# Altium project EGB220_ControlBoard.prjpcb
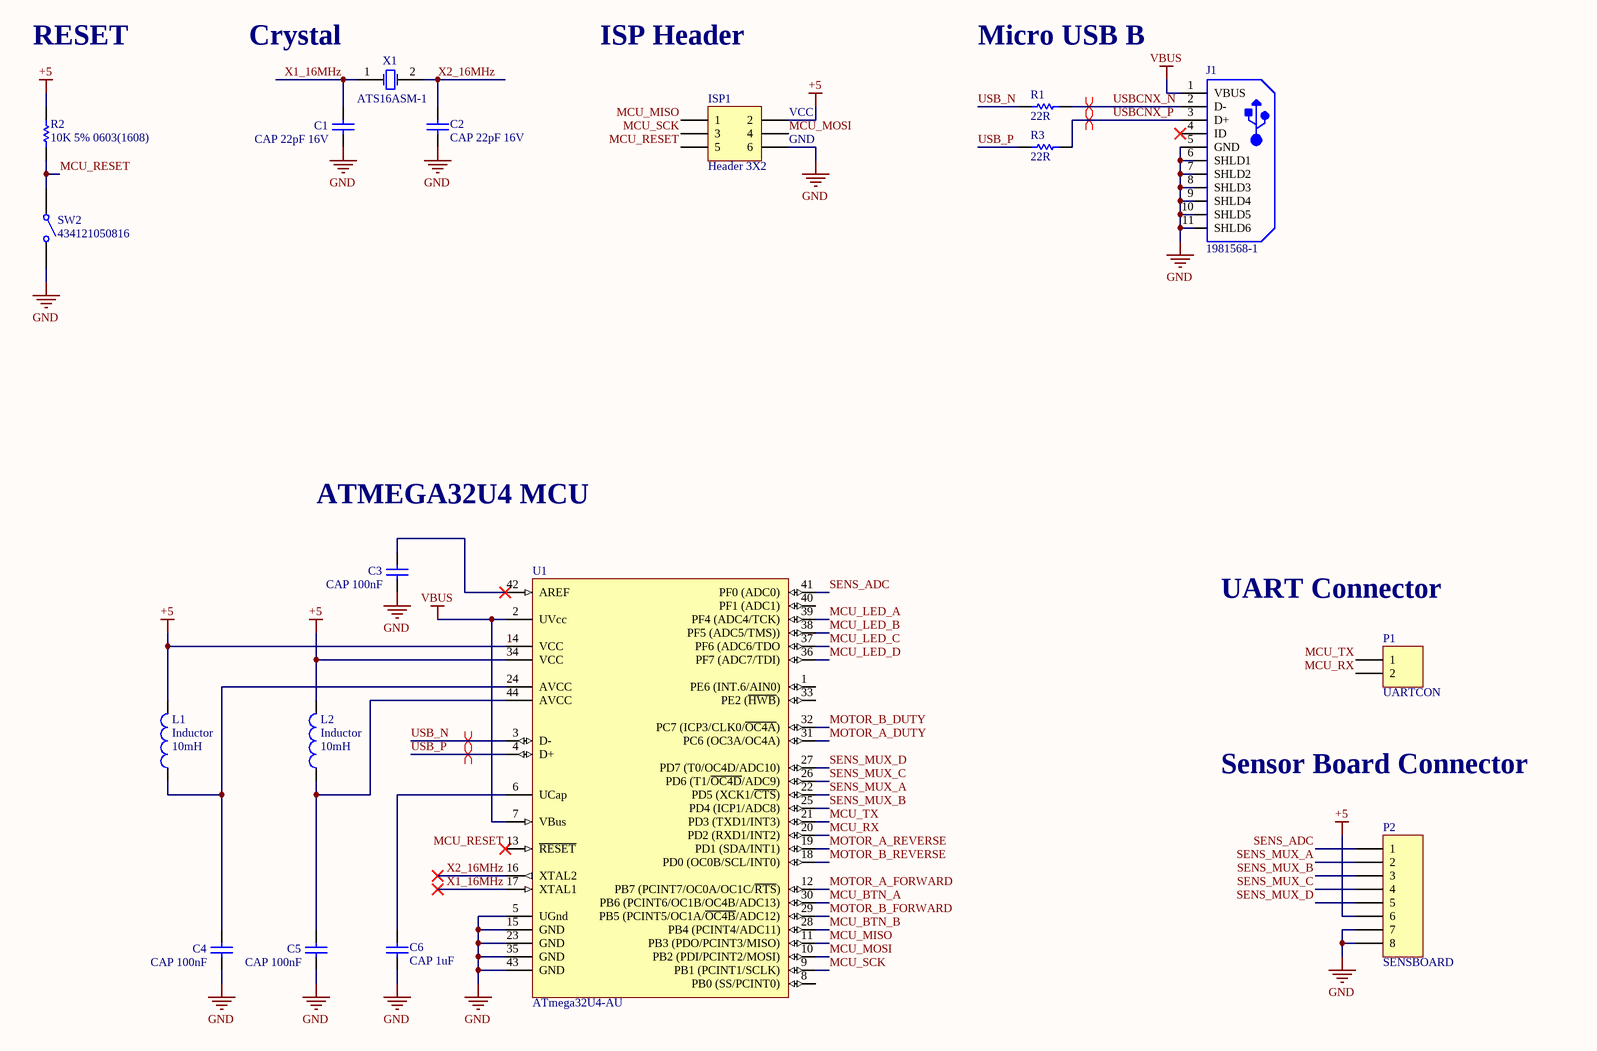
[diagram p0: Control.SchDoc]
4 sheets, 47 parts. Net scope: global (net labels, ports and power ports of the same name join across sheets).
Board file: Board.PcbDoc
Sheets:
  Control.SchDoc
  Input.SchDoc
  MotorDriver.SchDoc
  LinearRegulator.SchDoc

## Sheet Control.SchDoc: EGB220_ControlBoard
size A3

### Parts
C1  CAP 22pF 16V  [CAPC0603(1608)100_N]
C2  CAP 22pF 16V  [CAPC0603(1608)100_N]
C3  CAP 100nF  [CAPC0603(1608)100_M]
C4  CAP 100nF  [CAPC0603(1608)100_M]
C5  CAP 100nF  [CAPC0603(1608)100_M]
C6  CAP 1uF  [CAPC0603(1608)100_L]
ISP1  Header 3X2  [HDR2X3]
J1  1981568-1  [TECO-1981568-5_V]
L1  Inductor  value 10mH  [0603]
L2  Inductor  value 10mH  [0603]
P1  UARTCON  [HDR1X2]
P2  SENSBOARD  [HDR1X8]
R1  22R  [RESC0603(1608)_N]
R2  10K 5% 0603(1608)  [RESC0603(1608)_N]
R3  22R  [RESC0603(1608)_N]
SW2  434121050816  [434121050816]
U1  ATmega32U4-AU  [44ML_M]
X1  ATS16ASM-1  [CTS-ATS-SM-XTAL-2]

### Nets
+5: ISP1.2 L1.2 L2.2 P2.6 R2.2 U1.14(VCC) U1.34(VCC)
GND: C1.1 C2.2 C3.1 C4.1 C5.1 C6.1 ISP1.6 J1.5(GND) J1.6(SHLD1) J1.7(SHLD2) J1.8(SHLD3) J1.9(SHLD4) J1.10(SHLD5) J1.11(SHLD6) P2.7 P2.8 SW2.2 U1.5(UGnd) U1.15(GND) U1.23(GND) U1.35(GND) U1.43(GND)
VBUS: J1.1(VBUS) U1.2(UVcc) U1.7(VBus)
MCU_BTN_A: U1.30(PB6_(PCINT6/OC1B/OC4B/ADC13))
MCU_BTN_B: U1.28(PB4_(PCINT4/ADC11))
MCU_LED_A: U1.39(PF4_(ADC4/TCK))
MCU_LED_B: U1.38(PF5_(ADC5/TMS)))
MCU_LED_C: U1.37(PF6_(ADC6/TDO)
MCU_LED_D: U1.36(PF7_(ADC7/TDI))
MCU_MISO: ISP1.1 U1.11(PB3_(PDO/PCINT3/MISO))
MCU_MOSI: ISP1.4 U1.10(PB2_(PDI/PCINT2/MOSI))
MCU_RESET: ISP1.5 R2.1 SW2.1 U1.13(~{RESET})
MCU_RX: P1.2 U1.20(PD2_(RXD1/INT2))
MCU_SCK: ISP1.3 U1.9(PB1_(PCINT1/SCLK))
MCU_TX: P1.1 U1.21(PD3_(TXD1/INT3))
MOTOR_A_DUTY: U1.31(PC6_(OC3A/OC4A))
MOTOR_A_FORWARD: U1.12(PB7_(PCINT7/OC0A/OC1C/~{RTS}))
MOTOR_A_REVERSE: U1.19(PD1_(SDA/INT1))
MOTOR_B_DUTY: U1.32(PC7_(ICP3/CLK0/~{OC4A}))
MOTOR_B_FORWARD: U1.29(PB5_(PCINT5/OC1A/~{OC4B}/ADC12))
MOTOR_B_REVERSE: U1.18(PD0_(OC0B/SCL/INT0))
SENS_ADC: P2.1 U1.41(PF0_(ADC0))
SENS_MUX_A: P2.2 U1.22(PD5_(XCK1/~{CTS}))
SENS_MUX_B: P2.3 U1.25(PD4_(ICP1/ADC8))
SENS_MUX_C: P2.4 U1.26(PD6_(T1/~{OC4D}/ADC9))
SENS_MUX_D: P2.5 U1.27(PD7_(T0/OC4D/ADC10))
USB_N: R1.1 U1.3(D-)
USB_P: R3.1 U1.4(D+)
USBCNX_N: J1.2(D-) R1.2
USBCNX_P: J1.3(D+) R3.2
X1_16MHz: C1.2 U1.17(XTAL1) X1.1(X1)
X2_16MHz: C2.1 U1.16(XTAL2) X1.2(X2)
NetC3_2: C3.2 U1.42(AREF)
NetC4_2: C4.2 L1.1 U1.24(AVCC)
NetC5_2: C5.2 L2.1 U1.44(AVCC)
NetC6_2: C6.2 U1.6(UCap)

Not connected (* = marked no-connect by the designer): J1 4(ID)*; U1 1(PE6_(INT.6/AIN0)) 8(PB0_(SS/PCINT0)) 33(PE2_(~{HWB})) 40(PF1_(ADC1))

### Layout directives
differential pair: USB_N, USB_P, USBCNX_N, USBCNX_P

### Notes on the sheet
- RESET
- Crystal
- ISP Header
- Micro USB B
- (near ISP1) VCC
- (near ISP1) GND
- ATMEGA32U4 MCU
- UART Connector
- Sensor Board Connector
- Title
- Size:
- Date:
- A3
- Number:
- Time:
- Revision:
- Sheet
- of
- File:

### Library data of the parts
C1 C2 = CMP-1035-00808-1: CAP 22pF 16V ±5% 0603 (1608 Metric) Thickness 1mm SMD; Tolerance: Â±5%; Case-EIA: 0603; Case-Metric: 1608; Technology: SMT; Value: 22pF; Rated Voltage: 16 V; Max Thickness: 1 mm
C3-C5 = CMP-1035-02583-1: CAP 100nF 16V ±5% 0603 (1608 Metric) Thickness 1mm SMD; Tolerance: Â±5%; Case-Metric: 1608; Case-EIA: 0603; Rated Voltage: 16 V; Max Thickness: 1 mm; Technology: SMT; Value: 100nF
C6 = CMP-1035-02740-1: CAP 1uF 25V ±10% 0603 (1608 Metric) Thickness 1mm SMD; Tolerance: Â±10%; Case-Metric: 1608; Case-EIA: 0603; Technology: SMT; Rated Voltage: 25 V; Max Thickness: 1 mm; Value: 1uF
ISP1 = Header 3X2: Header, 3-Pin, Dual row; LatestRevisionDate: 17-Jul-2002; LatestRevisionNote: Re-released for DXP Platform.; Publisher: Altium Limited
J1 = CMP-2000-05408-1: Micro USB Receptacle Standard Type B Assy, 5-Pin SMD, RoHS, Tape and Reel; Manufacturer: TE Connectivity; Body Orientation: RightAngle; Number of Ports: 1Port; Number of Contacts: 5POS; Gender: RCP; Voltage Rating Max: 30VAC; Product Depth (mm): 5.6mm; Pitch (mm): 0.65mm; Current Rating (Max): 1/ContactA; Product Length (mm): 8mm; Product Height (mm): 3mm; Operating Temperature Max Deg. C: 85C; Datasheet URL: http://www.mouser.com/ds/2/418/NG_CD_1981568_E2-621296.pdf; Termination Method: Solder; Number of Terminals: 5; Operating Temp Range: -55Cto85C; Mounting Style: SurfaceMount; Manufacturer URL: http://www.te.com/; Contact Material: CopperAlloy; Packaging: TapeandReel; Datasheet Version: Rev. E2, 08/2015; Operating Temperature Min Deg. C: -55C; Housing Material: Thermoplastic; Type: MicroUSB; Contact Plating: GoldOverNickel
L1 L2 = Inductor: Code_IEC: 1005; Published: 8-Jun-2000; LatestRevisionDate: 29-May-2009; LatestRevisionNote: IPC-7351 Footprint Added.; PackageReference: 0402-A; Publisher: Altium Limited; PackageDescription: Chip Inductor; Code_JEITA: 0402
P1 = Header 2: Header, 2-Pin; LatestRevisionDate: 17-Jul-2002; LatestRevisionNote: Re-released for DXP Platform.; Publisher: Altium Limited
P2 = Header 8: Header, 8-Pin; System: Connector; LatestRevisionDate: 17-Jul-2002; LatestRevisionNote: Re-released for DXP Platform.; Publisher: Altium Limited
R1 R3 = CMP-1012-00034-1: 22R 0.1W 5% 0603 (1608 Metric)  SMD; Value: 22.00 Ohm; Case-EIA: 0603; Case-Metric: 1608; Technology: SMT; Power: 0.1 W; Tolerance: 5 %
R2 = CMP-1012-00098-1: 10K 0.1W 5% 0603 (1608 Metric)  SMD; Case-EIA: 0603; Value: 10000.00 Ohm; Case-Metric: 1608; Technology: SMT; Tolerance: 5 %; Power: 0.1 W
SW2 = CMP-1459-00007-1: WS-TASV SMD Tact Switch 6.0X3.5 mm; Manufacturer: Wuerth Elektronik; NoPins: 02; ComponentLink1Description: Manufacturer URL; PackageReference: 434121050816; PartNumber: 434121050816; ComponentLink2URL: http://katalog.we-online.de/em/datasheet/434121050816.pdf; ComponentLink1URL: http://www.we-online.com; ComponentLink2Description: Datasheet
U1 = CMP-0095-00285-2: 8-bit AVR Microcontroller, 2.7-5.5V, 16MHz, 32KB Flash, 1KB EEPROM, 2.5KB SRAM, USB Controller, 44-pin TQFP, Industrial Grade (-40°C to 85°C), Ext Osc; RevisionNote: DatasheetVersion updated. URLs added.; ComponentLink1Description: Manufacturer URL; PackageDescription: 44-Pin Plastic Thin Quad Flat Pack, 10 x 10 x 1.0 mm Body, 0.8 mm Pitch (TQFP); DatasheetVersion: revF, Nov-2010; ComponentLink2URL: http://www.atmel.com/dyn/resources/prod_documents/doc7766.pdf; ComponentLink1URL: http://www.atmel.com/; PackageReference: 44ML; ComponentLink2Description: ATmega16U4/32U4 Datasheet; PackageVersion: rev.G, Jul-2007; ComponentLink3URL: http://www.atmel.com/dyn/resources/prod_documents/7766S.pdf; ComponentLink3Description: ATmega16U4 ATmega32U4 Summary
X1 = CMP-0585-00002-2: ATS-SM Series Quartz Crystal, 16 MHz, -20 to 70 degC, 11.1 x 4.83 x 4.3mm SMD, RoHS, Tape and Reel; Manufacturer: CTS Corporation; Shunt Capacitance (C0): 7.0 pF Max; Frequency: 16 MHz; Oscillation Mode: Fundamental or 3rd Overtone; Crystal Cut: AT-Cut; ESR Maximum: 40 Ohms; Drive Level (Type): 100 uW; PackageDescription: 2-Pin SMD, Body 11.1 x 4.83 mm, Pitch 8.5 mm; PackageReference: ATS-SM-XTAL-2; ComponentLink1URL: http://www.ctscorp.com/; PartNumber: ATS16ASM-1; RoHS: TRUE; ComponentLink1Description: Manufacturer URL; Operating Temperature: -20 to 70 degC; DatasheetVersion: Rev. K; ComponentLink2Description: Datasheet; Packing: Tape and Reel; ComponentLink2URL: http://www.ctscorp.com/components/Datasheets/008-0309-0.pdf; Mounting Technology: Surface Mount; ComponentLink3URL: http://www.ctscorp.com/components/Datasheets/008-0309-0.pdf; ComponentLink3Description: Package Specification

## Sheet Input.SchDoc
size A4
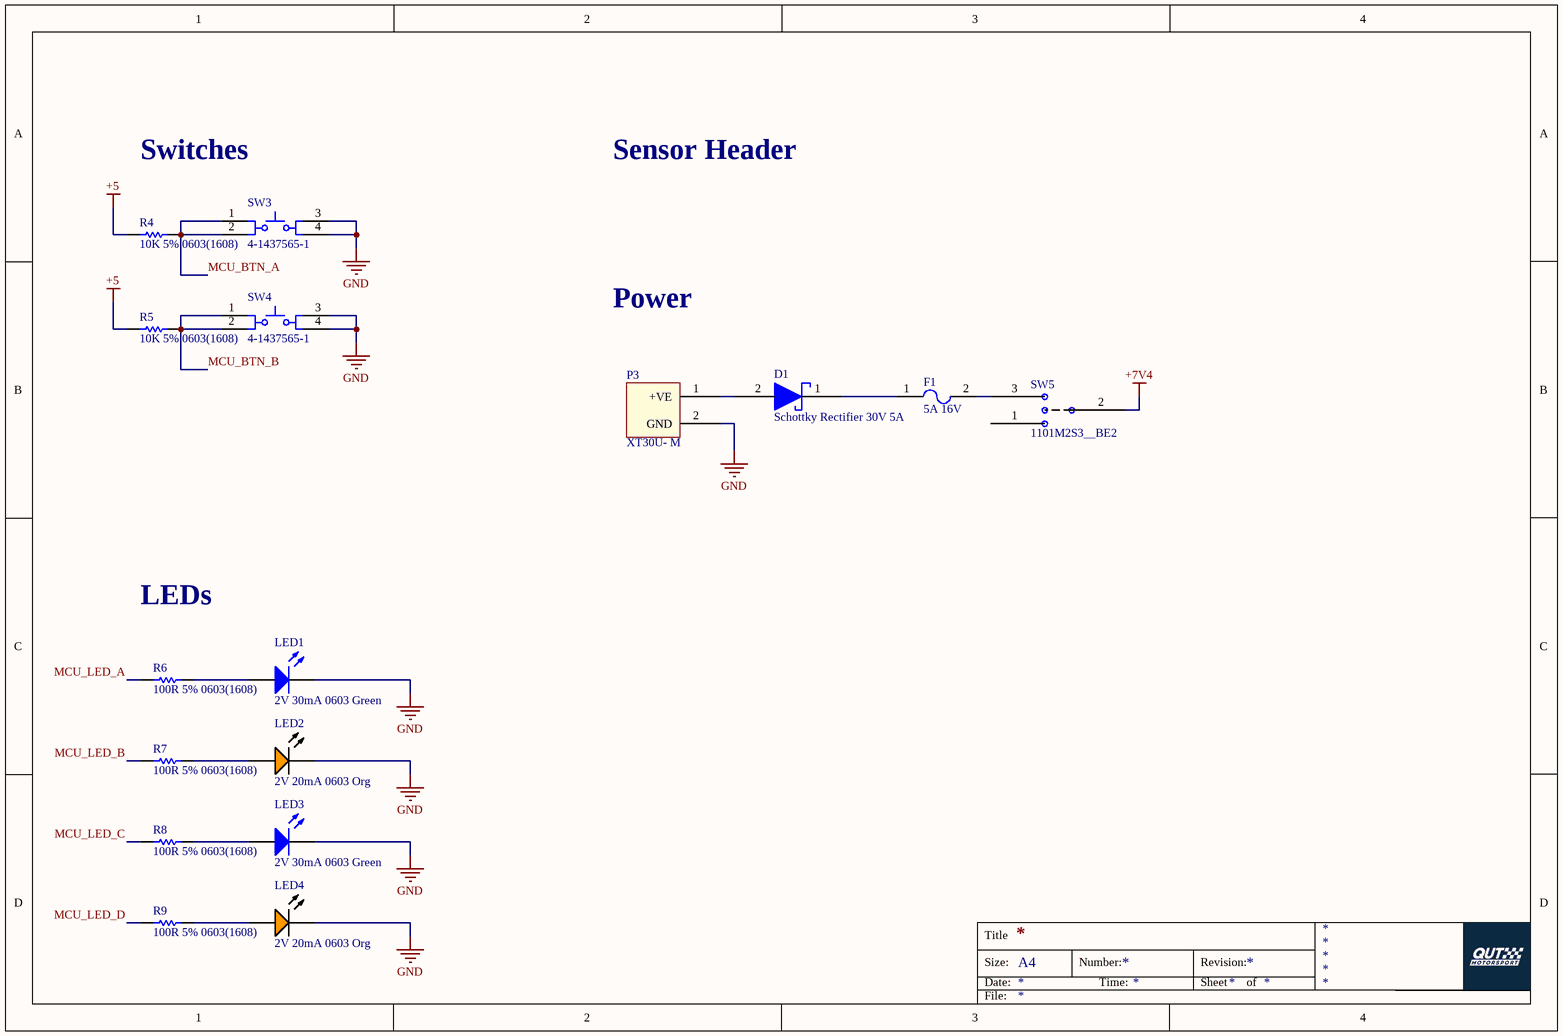
[diagram p1: Input.SchDoc]

### Parts
D1  Schottky Rectifier 30V 5A  [Schottky Diode 30V 5A]
F1  5A 16V  [Fuse 5A 16V 1812]
LED1  2V 30mA 0603 Green  [0603_A]
LED2  2V 20mA 0603 Org  [KING-LED0603-25-ORANGE_V]
LED3  2V 30mA 0603 Green  [0603_A]
LED4  2V 20mA 0603 Org  [KING-LED0603-25-ORANGE_V]
P3  XT30U- M  [XT30U-M]
R4  10K 5% 0603(1608)  [RESC0603(1608)_N]
R5  10K 5% 0603(1608)  [RESC0603(1608)_N]
R6  100R 5% 0603(1608)  [RESC0603(1608)_L]
R7  100R 5% 0603(1608)  [RESC0603(1608)_L]
R8  100R 5% 0603(1608)  [RESC0603(1608)_L]
R9  100R 5% 0603(1608)  [RESC0603(1608)_L]
SW3  4-1437565-1  [TECO-4-1437565-1_V]
SW4  4-1437565-1  [TECO-4-1437565-1_V]
SW5  1101M2S3__BE2  [1101M2S3__BE2]

### Nets
+5: R4.2 R5.2
+7V4: SW5.2
GND: LED1.1(K) LED2.2(K) LED3.1(K) LED4.2(K) P3.2(GND) SW3.3 SW3.4 SW4.3 SW4.4
MCU_BTN_A: R4.1 SW3.1 SW3.2
MCU_BTN_B: R5.1 SW4.1 SW4.2
MCU_LED_A: R6.1
MCU_LED_B: R7.2
MCU_LED_C: R8.1
MCU_LED_D: R9.2
NetD1_1: D1.1(K) F1.1
NetD1_2: D1.2(A) P3.1(+VE)
NetF1_2: F1.2 SW5.3
NetLED1_2: LED1.2(A) R6.2
NetLED2_1: LED2.1(A) R7.1
NetLED3_2: LED3.2(A) R8.2
NetLED4_1: LED4.1(A) R9.1

Not connected (* = marked no-connect by the designer): SW5 1

### Notes on the sheet
- Switches
- Sensor Header
- Power
- LEDs
- Title
- Size:
- Date:
- A4
- Number:
- Time:
- Revision:
- Sheet
- of
- File:

### Library data of the parts
F1 = Fuse 16V 5A 1812: ComponentLink1Description: Datasheet; ComponentLink1URL: https://www.bourns.com/docs/Product-Datasheets/mfmsmf.pdf; ComponentLink2Description: Supplier; ComponentLink2URL: https://www.digikey.com.au/product-detail/en/bourns-inc/MF-MSMF250-16X-2/MF-MSMF250-16X-2CT-ND/3437789
LED1 LED3 = CMP-1426-00006-1: SMD mono-color Chip LED, WL-SMCW, Bright Green; PartNumber: 150060VS75000; Manufacturer: Wuerth Elektronik; ComponentLink2URL: http://katalog.we-online.com/led/datasheet/150060VS75000.pdf; ComponentLink1Description: Manufacturer URL; PackageReference: 0603_A; ComponentLink2Description: Datasheet; ComponentLink1URL: http://www.we-online.com; Color: Bright Green
LED2 LED4 = CMP-0239-00002-1: LED, SMT, 0603(1608), 0.25mm Tthickness, Super Bright Orange; PartNumber: APG1608SEKC/T; Forward Current: 30 mA; Power Dissipation: 75 mW; Reverse Voltage: 5 V; Packing: Reel; PackageDescription: 2-Pin SMT LED, 1.6 x 0.8 mm Body, 0.25mm Thickness; ComponentLink1URL: http://www.kingbrightusa.com/; PackageVersion: Rev. 4A, 12/2011; Storage Temperature: -40 to 85 degC; Mounting Technology: Surface Mount; ComponentLink2Description: Datasheet; DatasheetVersion: Rev. 4A, 12/2011; ComponentLink2URL: http://www.kingbrightusa.com/images/catalog/SPEC/APG1608SEKC-T.pdf; PackageReference: LED0603-25-ORANGE; ComponentLink1Description: Manufacturer URL
R4 R5 = CMP-1012-00098-1: as R2 on sheet Control; Technology: SMT; Tolerance: 5 %; Power: 0.1 W
R6-R9 = CMP-1012-00050-1: 100R 0.1W 5% 0603 (1608 Metric)  SMD; Case-EIA: 0603; Value: 100.00 Ohm; Case-Metric: 1608; Tolerance: 5 %; Technology: SMT; Power: 0.1 W
SW3 SW4 = CMP-2000-05602-1: Tactile Switch, 50 mA, 12 VDC, -20 to 85 degC, 4-Pin SMD, RoHS, Bulk; Manufacturer: TEConnectivity/AMPBrand; Illumination Type: N/R; Maximum Contact Resistance: 100mOhm; Actuator Style: RoundButton; Actuator Length: 1.4mm; Contact Rating @ Voltage: 0.05@12VDCA; Maximum DC Voltage Rating: 12V; Body Orientation: Straight; Ground Terminal: No; Dielectric Strength: 500VAC; Operating Force: 1.57N; Electrical Life: 100000Cycle; Mechanical Life: N/A; Family: FSMJSMA; Contact Material: CopperAlloy; Type: N/A; RoHS: Yes; Pole Throw Configuration: N/A; Operating Temperature: -20to85C; Minimum Insulation Resistance: 100MOhm; Package Description: 4-Pin Surface Mount Device, Body 6 x 6 mm, Pitch 9.1 mm; Housing Material: N/A; Switch Configuration: N/A; Mounting: SurfaceMount,GullWing; Datasheet URL: https://datasheet.ciiva.com/14635/0900766b80912216-14635826.pdf; Packaging: Bulk; Base Material: N/A; Actuator Color: N/A; Dimension: 6x10x5.25mm; Contact Plating: Silver; Seal Location: N/A; Mounting Technology: SurfaceMount; Part No: 4-1437565-1; Seal Description: N/A; Maximum AC Voltage Rating: N/A; Datasheet Version: 04/2007; Manufacturer URL: http://www.te.com/; Package Reference: 4-1437565-1; Product Weight: N/A
D1 = Schottky Rectifier 30V 5A: ComponentLink1Description: Datasheet; ComponentLink1URL: https://assets.nexperia.com/documents/data-sheet/PMEG3050EP.pdf

## Sheet MotorDriver.SchDoc
size A4
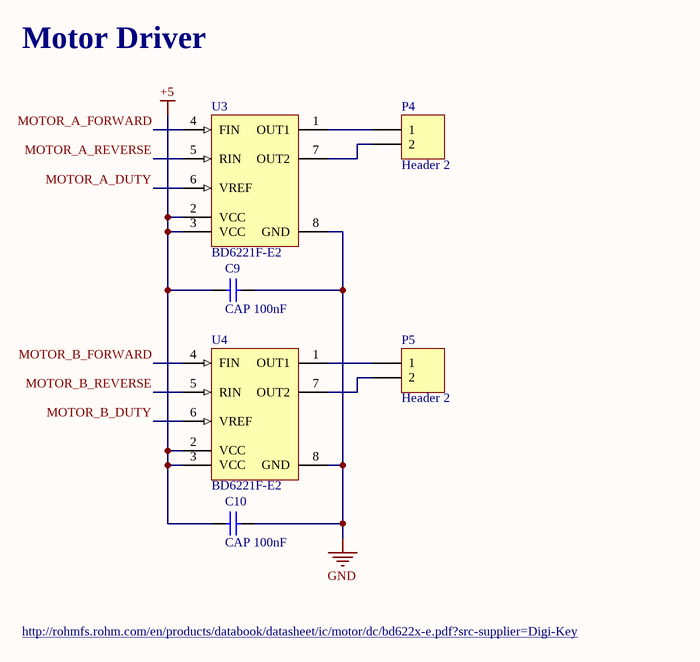
[diagram p2: MotorDriver.SchDoc]

### Parts
C9  CAP 100nF  [CAPC0603(1608)100_M]
C10  CAP 100nF  [CAPC0603(1608)100_M]
P4  Header 2  [HDR1X2]
P5  Header 2  [HDR1X2]
U3  BD6221F-E2  [ROHM-SOP-8_V]
U4  BD6221F-E2  [ROHM-SOP-8_V]

### Nets
+5: C9.2 C10.2 U3.2(VCC) U3.3(VCC) U4.2(VCC) U4.3(VCC)
GND: C9.1 C10.1 U3.8(GND) U4.8(GND)
MOTOR_A_DUTY: U3.6(VREF)
MOTOR_A_FORWARD: U3.4(FIN)
MOTOR_A_REVERSE: U3.5(RIN)
MOTOR_B_DUTY: U4.6(VREF)
MOTOR_B_FORWARD: U4.4(FIN)
MOTOR_B_REVERSE: U4.5(RIN)
NetP4_1: P4.1 U3.1(OUT1)
NetP4_2: P4.2 U3.7(OUT2)
NetP5_1: P5.1 U4.1(OUT1)
NetP5_2: P5.2 U4.7(OUT2)

### Notes on the sheet
- Motor Driver
- http://rohmfs.rohm.com/en/products/databook/datasheet/ic/motor/dc/bd622x-e.pdf?src-supplier=Digi-Key

### Library data of the parts
C9 C10 = CMP-1035-02583-1: as C3 on sheet Control; Rated Voltage: 16 V; Max Thickness: 1 mm; Technology: SMT; Value: 100nF
P4 P5 = Header 2: Header, 2-Pin; LatestRevisionDate: 17-Jul-2002; LatestRevisionNote: Re-released for DXP Platform.; Publisher: Altium Limited
U3 U4 = CMP-1539-00001-1: DC Brush Motor Driver, 6 to 18 V, 1 A, -40 to 85 degC, 8-Pin SOP, RoHS, Tape and Reel; Manufacturer: ROHM Semiconductor; Supply Voltage: 6 to 15 V; RON@IOUT: 0.5 A=1.5 Ohm Typ.; Output Current: 1 A Max.; ComponentLink1URL: http://www.rohm.com/web/global/; Mounting Technology: Surface Mount; DatasheetVersion: Rev. 003; ComponentLink2Description: Datasheet; RoHS: TRUE; ComponentLink3URL: http://rohmfs.rohm.com/en/products/databook/package/spec/ic/sop-1-2-e.pdf; ComponentLink1Description: Manufacturer URL; PartNumber: BD6221F-E2; PackageDescription: 8-Pin Small Outline Package, Body 5 x 4.4 mm, Pitch 1.27 mm; ComponentLink3Description: Package Specification; ComponentLink2URL: http://rohmfs.rohm.com/en/products/databook/datasheet/ic/motor/dc/bd622x-e.pdf; Temperature Range: -40 to 85 degC; PackageVersion: Rev. A; Packing: Tape and Reel

## Sheet LinearRegulator.SchDoc
size A4
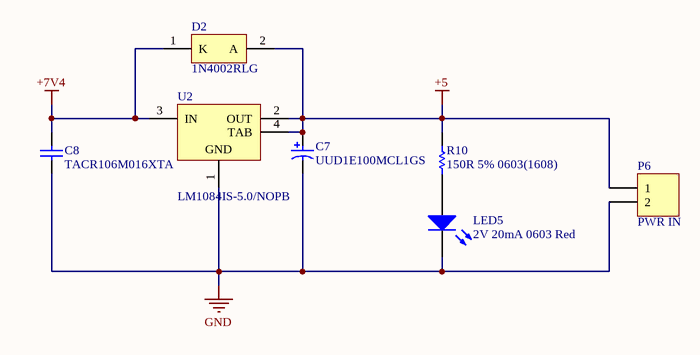
[diagram p3: LinearRegulator.SchDoc]

### Parts
C7  UUD1E100MCL1GS  [NIC-CAPA2-4X5.8_V]
C8  TACR106M016XTA  [CAPC2014X150X70NL20]
D2  1N4002RLG  [ONSC-AXIAL_LEAD-2-59-10_P]
LED5  2V 20mA 0603 Red  [0603_A]
P6  PWR IN  [HDR1X2]
R10  150R 5% 0603(1608)  [RESC0603(1608)_L]
U2  LM1084IS-5.0/NOPB  [KTT0003B_L]

### Nets
+5: C7.1 D2.2(A) P6.1 R10.2 U2.2(OUT) U2.4(TAB)
+7V4: C8.2 D2.1(K) U2.3(IN)
GND: C7.2 C8.1 LED5.1(K) P6.2 U2.1(GND)
NetLED5_2: LED5.2(A) R10.1

### Library data of the parts
C7 = CMP-0687-00016-1: Aluminum Electrolytic Capacitor, UD Series, Low Impedance, 10 uF, 25 V, + / - 20%, -55 to 105 degC, Chip Type, 4 x 5.8 mm D x L, Pb-Free, Reel; Manufacturer: Nichicon; Endurance Time: 2000 h; Packing: Dia382mm Reel; Rated Ripple Current (at 100kHz): 80 mA; Tolerance Rated Capacitance: -20 to 20%; Impedance: 1.8 Ohm; Rated Capacitance: 10 uF; Rated Voltage: 25 V; ComponentLink3URL: http://products.nichicon.co.jp/en/pdf/XJA043/e-ud.pdf; ComponentLink1Description: Manufacturer URL; DatasheetVersion: 08/2012; ComponentLink3Description: Package Specification; ComponentLink2Description: Datasheet; ComponentLink2URL: http://products.nichicon.co.jp/en/pdf/XJA043/e-ud.pdf; ComponentLink1URL: http://www.nichicon.co.jp/; Length: 5.8 mm; RoHS: TRUE; Diameter: 4 mm; Mounting Technology: Surface Mount; PackageDescription: 2-Pin Surface Mount Device, Diameter 4 mm, Height 5.8 mm, Pitch 3.6 mm; PartNumber: UUD1E100MCL1GS; PackageReference: CAPAE-D4H5.8
C8 = CMP-2007-00027-1: Manufacturer: AVX Interconnect / Elco; Part Number: TACR106M016XTA
D2 = CMP-0902-00183-1: Standard Recovery Rectifier, 2-Pin Axial_Lead, Pb-Free, Tape and Reel; Manufacturer: On Semiconductor; IO(rec) Max (A): 1; VRRM Max (V): 100; IFSM Max (A): 30; DatasheetVersion: Rev. 13; RoHS: TRUE; Packing: Tape and Reel; PackageVersion: Rev. U, 02/2005; ComponentLink3Description: Package Specification; ComponentLink1Description: Manufacturer URL; ComponentLink2Description: Datasheet; ComponentLink3URL: http://www.onsemi.cn/pub_link/Collateral/59-10.PDF; PackageDescription: 2-Pin, Axial Lead, Diameter 2.35 mm; PackageReference: AXIAL_LEAD-2-59-10; ComponentLink2URL: http://www.onsemi.com/pub_link/Collateral/1N4001-D.PDF; ComponentLink1URL: http://www.onsemi.com/; Mounting Technology: Through Hole; PartNumber: 1N4002RLG; Type: Standard Recovery
LED5 = CMP-1426-00001-1: SMD mono-color Chip LED, WL-SMCW, Red; Manufacturer: Wuerth Elektronik; PartNumber: 150060RS75000; Color: Red; PackageReference: 0603_A; ComponentLink2URL: http://katalog.we-online.com/led/datasheet/150060RS75000.pdf; ComponentLink1URL: http://www.we-online.com; ComponentLink1Description: Manufacturer URL; ComponentLink2Description: Datasheet
P6 = Header 2: Header, 2-Pin; LatestRevisionDate: 17-Jul-2002; LatestRevisionNote: Re-released for DXP Platform.; Publisher: Altium Limited
R10 = CMP-1012-00054-1: 150R 0.1W 5% 0603 (1608 Metric)  SMD; Case-EIA: 0603; Value: 150.00 Ohm; Case-Metric: 1608; Power: 0.1 W; Tolerance: 5 %; Technology: SMT
U2 = CMP-0062-00575-5: 5A Low Dropout Positive Regulators, 3-pin TO-263, Pb-Free; Manufacturer: Texas Instruments; High-Reliability: Y; PackageTopMarking: NSUZXYTTE#*LM1084*IS-5.0; CompType: LDO IC; PowerWise: N; ComponentLink1URL: http://www.ti.com/general/docs/lit/getliterature.tsp?genericPartNumber=LM1084&fileType=pdf; PinCount: 3; PackageDescription: TO-263, Molded, .400 x .390 x .180in, 3 Lead, .1in Pitch, Surface Mount; PackageReference: KTT0003B; PartNumber: LM1084IS-5.0/NOPB; Code_JEDEC: MO-169-AA; RoHS: Y; ComponentLink1Description: Datasheet URL

## Nets that join several sheets
+5: Control (7 pins), Input (R4.2 R5.2), MotorDriver (6 pins), LinearRegulator (6 pins)
+7V4: Input (SW5.2), LinearRegulator (C8.2 D2.1 U2.3)
GND: Control (22 pins), Input (9 pins), MotorDriver (C9.1 C10.1 U3.8 U4.8), LinearRegulator (5 pins)
MCU_BTN_A: Control (U1.30), Input (R4.1 SW3.1 SW3.2)
MCU_BTN_B: Control (U1.28), Input (R5.1 SW4.1 SW4.2)
MCU_LED_A: Control (U1.39), Input (R6.1)
MCU_LED_B: Control (U1.38), Input (R7.2)
MCU_LED_C: Control (U1.37), Input (R8.1)
MCU_LED_D: Control (U1.36), Input (R9.2)
MOTOR_A_DUTY: Control (U1.31), MotorDriver (U3.6)
MOTOR_A_FORWARD: Control (U1.12), MotorDriver (U3.4)
MOTOR_A_REVERSE: Control (U1.19), MotorDriver (U3.5)
MOTOR_B_DUTY: Control (U1.32), MotorDriver (U4.6)
MOTOR_B_FORWARD: Control (U1.29), MotorDriver (U4.4)
MOTOR_B_REVERSE: Control (U1.18), MotorDriver (U4.5)